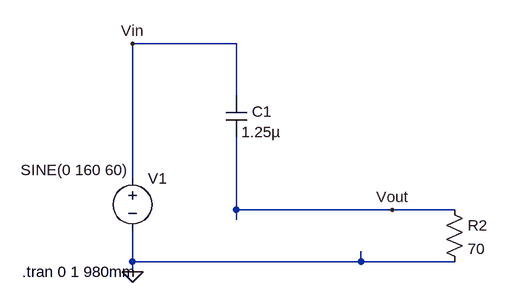
[diagram p0: schematic ac.asc]
ac.asc, the LTspice schematic file:
Version 4
SHEET 1 880 680
WIRE 160 -96 0 -96
WIRE 160 -16 160 -96
WIRE 0 112 0 -96
WIRE 160 160 160 48
WIRE 400 160 160 160
WIRE 496 160 400 160
WIRE 160 176 160 160
WIRE 0 240 0 192
WIRE 352 240 352 224
WIRE 352 240 0 240
WIRE 496 240 352 240
WIRE 0 256 0 240
FLAG 0 256 0
FLAG 400 160 Vout
FLAG 0 -96 Vin
SYMBOL cap 144 -16 R0
WINDOW 0 40 25 Left 2
SYMATTR InstName C1
SYMATTR Value 1.25µ
SYMBOL voltage 0 96 R0
WINDOW 3 -172 3 Left 2
WINDOW 123 0 0 Left 2
WINDOW 39 0 0 Left 2
SYMATTR InstName V1
SYMATTR Value SINE(0 160 60)
SYMBOL res 480 144 R0
SYMATTR InstName R2
SYMATTR Value 70
TEXT -170 256 Left 2 !.tran 0 1 980mm

The netlist it stands for:
* ac.asc
C1 Vin Vout 1.25µ
V1 Vin 0 SINE(0 160 60)
R2 Vout 0 70
.tran 0 1 980mm
.backanno
.end